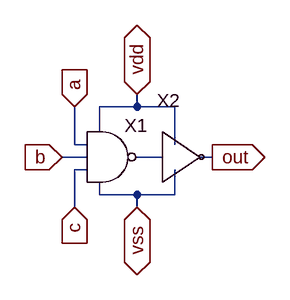
[diagram p0: schematic 3_way_and.asc]
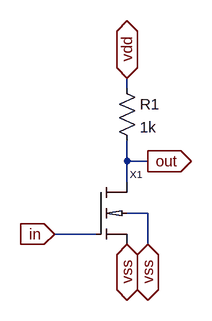
[diagram p1: sub-circuit not.asc]
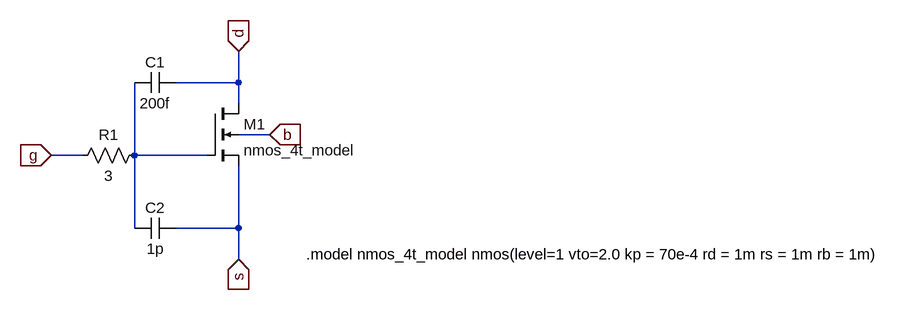
[diagram p2: sub-circuit nmos_4t.asc]
3_way_and.asc, the LTspice schematic file:
Version 4
SHEET 1 880 680
WIRE 192 96 192 80
WIRE 192 96 144 96
WIRE 240 96 192 96
WIRE 144 128 144 96
WIRE 112 144 112 96
WIRE 128 144 112 144
WIRE 240 144 240 96
WIRE 128 160 96 160
WIRE 224 160 192 160
WIRE 288 160 272 160
WIRE 128 176 112 176
WIRE 144 208 144 192
WIRE 192 208 144 208
WIRE 240 208 240 176
WIRE 240 208 192 208
WIRE 112 224 112 176
WIRE 192 224 192 208
FLAG 192 80 vdd
IOPIN 192 80 BiDir
FLAG 192 224 vss
IOPIN 192 224 BiDir
FLAG 288 160 out
IOPIN 288 160 Out
FLAG 112 224 c
IOPIN 112 224 In
FLAG 112 96 a
IOPIN 112 96 In
FLAG 96 160 b
IOPIN 96 160 In
SYMBOL 3_way_nand 160 96 R0
SYMATTR InstName X1
SYMBOL not 224 160 R0
SYMATTR InstName X2

not.asc, the sub-circuit schematic file:
Version 4
SHEET 1 880 680
WIRE 176 -96 176 -112
WIRE 176 16 176 -16
WIRE 208 16 176 16
WIRE 176 48 176 16
WIRE 208 96 176 96
WIRE 128 128 64 128
WIRE 208 144 208 96
FLAG 64 128 in
IOPIN 64 128 In
FLAG 176 144 vss
IOPIN 176 144 BiDir
FLAG 176 -112 vdd
IOPIN 176 -112 BiDir
FLAG 208 16 out
IOPIN 208 16 Out
FLAG 208 144 vss
IOPIN 208 144 BiDir
SYMBOL res 160 -112 R0
SYMATTR InstName R1
SYMATTR Value 1k
SYMBOL nmos_4t 128 48 R0
SYMATTR InstName X1

nmos_4t.asc, the sub-circuit schematic file:
Version 4
SHEET 1 880 680
WIRE -288 -224 -288 -272
WIRE -288 -224 -384 -224
WIRE -288 -192 -288 -224
WIRE -240 -144 -288 -144
WIRE -528 -112 -576 -112
WIRE -448 -112 -448 -224
WIRE -336 -112 -448 -112
WIRE -448 0 -448 -112
WIRE -288 0 -288 -96
WIRE -288 0 -384 0
WIRE -288 48 -288 0
FLAG -576 -112 g
IOPIN -576 -112 In
FLAG -288 -272 d
IOPIN -288 -272 In
FLAG -288 48 s
IOPIN -288 48 In
FLAG -240 -144 b
IOPIN -240 -144 In
SYMBOL nmos4 -336 -192 R0
SYMATTR InstName M1
SYMATTR Value nmos_4t_model
SYMBOL cap -384 -240 R90
WINDOW 0 0 32 VBottom 2
WINDOW 3 32 32 VTop 2
SYMATTR InstName C1
SYMATTR Value 200f
SYMBOL cap -384 -16 R90
WINDOW 0 0 32 VBottom 2
WINDOW 3 32 32 VTop 2
SYMATTR InstName C2
SYMATTR Value 1p
SYMBOL res -432 -128 R90
WINDOW 0 0 56 VBottom 2
WINDOW 3 32 56 VTop 2
SYMATTR InstName R1
SYMATTR Value 3
TEXT -184 40 Left 2 !.model nmos_4t_model nmos(level=1 vto=2.0 kp = 70e-4 rd = 1m rs = 1m rb = 1m)

The netlist it stands for:
* 3_way_and.asc
XX1 a b vdd vss N001 c 3_way_nand  ; pins a b vdd vss out c
XX2 N001 out vss vdd not

* block symbol definitions
.subckt not in out vss vdd
R1 vdd out 1k
XX1 out in vss vss nmos_4t
.ends not

.subckt nmos_4t D G S B
M1 d N001 s b nmos_4t_model
C1 d N001 200f
C2 s N001 1p
R1 N001 g 3
.model nmos_4t_model nmos(level=1 vto=2.0 kp = 70e-4 rd = 1m rs = 1m rb = 1m)
.ends nmos_4t

.model NMOS NMOS
.model PMOS PMOS
.lib standard.mos
.backanno
.end